# EAGLE design smartcar_shield_cutouts (EAGLE 9.4.0)
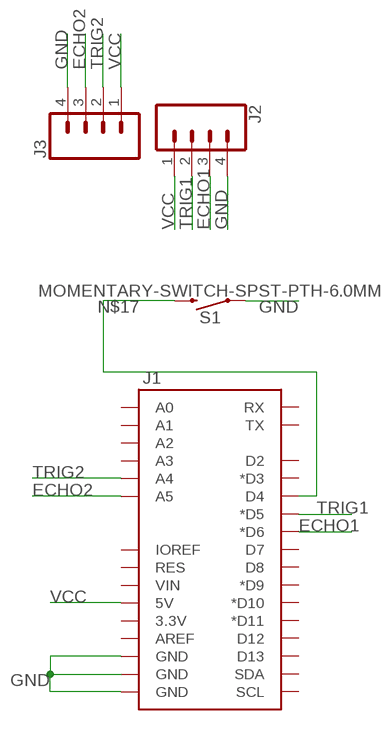
[diagram p0: schematic, sheet 1]

## Parts
J1  ARDUINO_R3_SHIELDUNO_R3_SHIELD_LOCK  [UNO_R3_SHIELD_LOCK]
J2  CONN_04  [1X04]
J3  CONN_04  [1X04]
S1  MOMENTARY-SWITCH-SPST-PTH-6.0MM  [TACTILE_SWITCH_PTH_6.0MM]

## Nets
ECHO1: J1.D6(*D6) J2.3
ECHO2: J1.A5 J3.3
GND: J1.GND@0(GND) J1.GND@1(GND) J1.GND@2(GND) J2.4 J3.4 S1.1
N$17: J1.D4 S1.3
TRIG1: J1.D5(*D5) J2.2
TRIG2: J1.A4 J3.2
VCC: J1.5V J2.1 J3.1
Unconnected: J1.3.3V J1.A0 J1.A1 J1.A2 J1.A3 J1.AREF J1.D2 J1.D3(*D3) J1.D7 J1.D8 J1.D9(*D9) J1.D10(*D10) J1.D11(*D11) J1.D12 J1.D13 J1.IOREF J1.RES J1.RX J1.SCL J1.SDA J1.TX J1.VIN

## Library data of the parts
J1 = SparkFun-Boards:ARDUINO_R3_SHIELD: Shield form compatible with the Arduino Uno R3.
J2 J3 = SparkFun-Connectors:CONN_04: Multi connection point. Often used as Generic Header-pin footprint for 0.1 inch spaced/style header connections On any of the 0.1 inch spaced packages, you can populate with these: Break Away Headers - Straight <https://www.sparkfun.com/products/116> (PRT-00116) Break Away Male Headers - Right Angle <https://www.sparkfun.com/products/553> (PRT-00553) Female Headers <https://www.sparkfun.com/products/115> (PRT-00115) Break Away Headers - Machine Pin <https://www.sparkfun.com/products/117> (PRT-00117) Break Away Female Headers - Swiss Machine Pin <https://www.sparkfun.com/products/743> (PRT-00743) For SCREWTERMINALS and SPRING TERMINALS visit here: Screw Terimnals on SparkFun.com <https://www.sparkfun.com/search/results?term=Screw+Terminals> (5mm/3.5mm/2.54mm spacing) This device is also useful as a general connection point to wire up your design to another part of your project. Our various solder wires solder well into these plated through hole pads. Hook-Up Wire - Assortment (Stranded, 22 AWG) <https://www.sparkfun.com/products/11375> (PRT-11375) Hook-Up Wire - Assortment (Solid Core, 22 AWG) <https://www.sparkfun.com/products/11367> (PRT-11367) View the entire wire category on our website here <https://www.sparkfun.com/categories/141> Special notes: Molex polarized connector foot print use with SKU : PRT-08231 with associated crimp pins and housings. 1MM SMD Version SKU: PRT-10208; PROD_ID: CONN-09696
S1 = SparkFun-Switches:MOMENTARY-SWITCH-SPST: Momentary Switch (Pushbutton) - SPST Normally-open (NO) SPST momentary switches (buttons, pushbuttons). Variants PTH-12MM - 12mm square, through-hole Momentary Pushbutton Switch - 12mm Square <https://www.sparkfun.com/products/9190> (COM-09190) PTH-6.0MM, PTH-6.0MM-KIT - 6.0mm square, through-hole Mini Pushbutton Switch <https://www.sparkfun.com/products/97> (COM-00097) KIT package intended for soldering kit's - only one side of pads' copper is exposed. PTH-RIGHT-ANGLE-KIT - Right-angle, through-hole Right Angle Tactile Button <https://www.sparkfun.com/products/10791> - Used on SparkFun BigTime Watch Kit <https://www.sparkfun.com/products/11734> SMD-12MM - 12mm square, surface-mount Tactile Button - SMD (12mm) <https://www.sparkfun.com/products/12993> (COM-12993) Used on SparkFun PicoBoard <https://www.sparkfun.com/products/11888> SMD-4.5MM - 4.5mm Square Trackball Switch Used on SparkFun Blackberry Trackballer Breakout <https://www.sparkfun.com/products/13169> SMD-4.6MMX2.8MM - 4.60mm x 2.80mm, surface mount Used on SparkFun SAMD21 Mini Breakout <https://www.sparkfun.com/products/13664> SMD-5.2MM, SMD-5.2-REDUNDANT - 5.2mm square, surface-mount Mini Pushbutton Switch - SMD <https://www.sparkfun.com/products/8720> (COM-08720) Used on Arduino Pro Mini <https://www.sparkfun.com/products/11114> REDUNDANT package connects both switch circuits together SMD-6.0X3.5MM - 6.0 x 3.5mm, surface mount Momentary Reset Switch SMD <https://www.sparkfun.com/products/8229> (COM-08229) SMD-6.2MM-TALL - 6.2mm square, surface mount Tactile Button - SMD (6mm) <https://www.sparkfun.com/products/12992> Used on SparkFun Digital Sandbox <https://www.sparkfun.com/products/12651> SMD-RIGHT-ANGLE - Right-angle, surface mount Used on SparkFun Block for Intel® Edison - Arduino <https://www.sparkfun.com/products/13036>; PROD_ID: SWCH-08441; SF_SKU: COM-00097

## Net classes
0 default: width 0.152 mm, drill 0.305 mm, clearance 0.152 mm

## Board
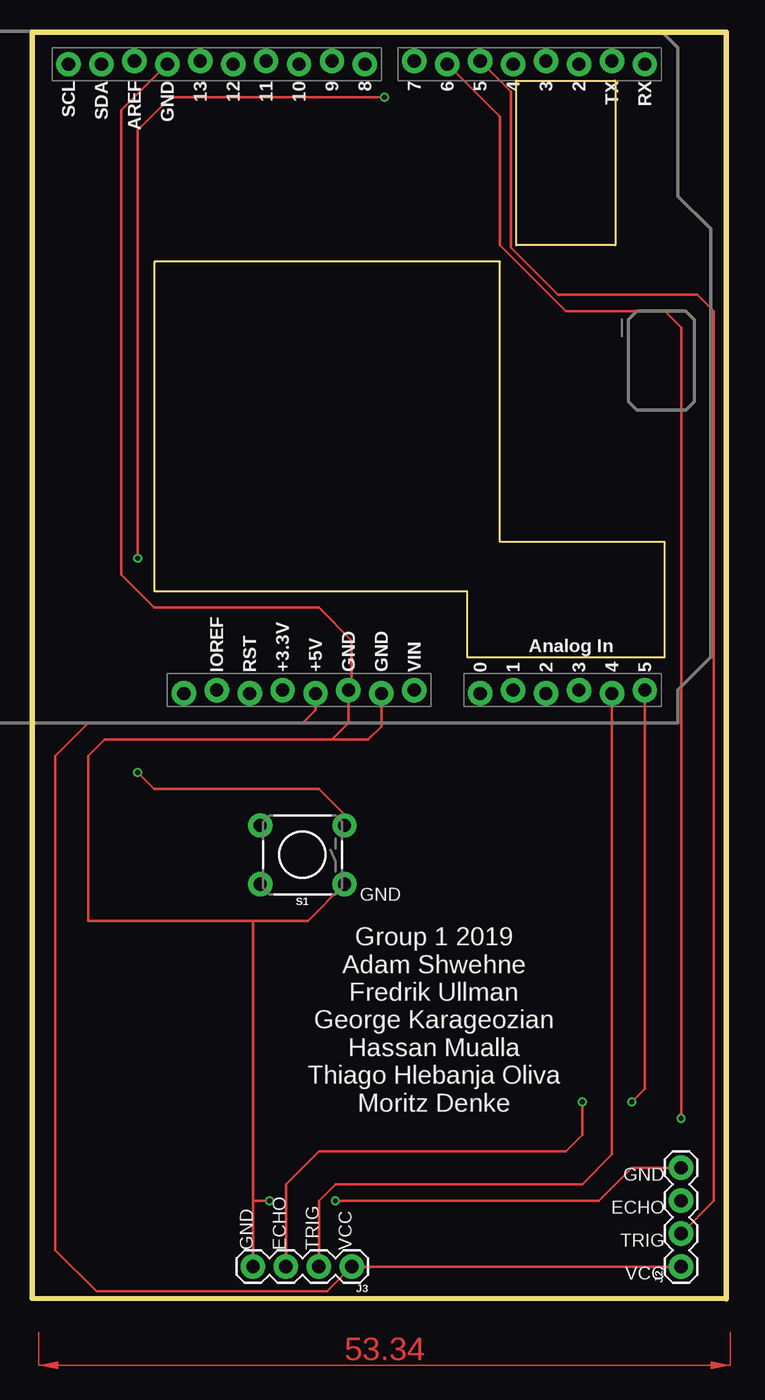
[diagram p1: board, top side]
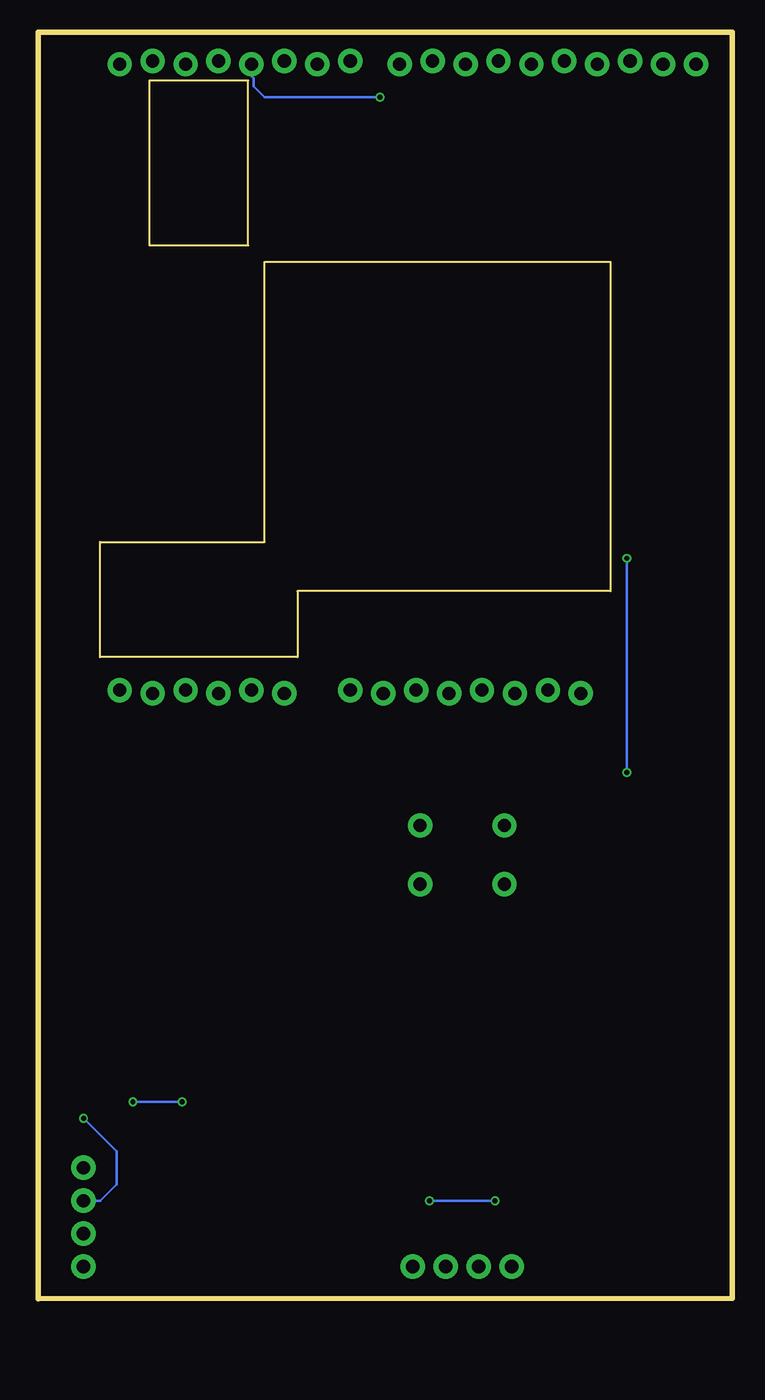
[diagram p2: board, bottom side, seen from below]

Size 53.51 x 97.65 mm. Coordinates in mm from the lower left corner, seen from the top.
Outline: 0,97.65 53.51,97.65 53.51,0 0,0.05 0,97.65
Outline: 9.39,79.96 9.39,54.56 33.52,54.56 33.52,49.48 48.76,49.48 48.76,58.37 36.06,58.37 36.06,79.96 9.39,79.96
Outline: 44.95,81.23 37.33,81.23 37.33,93.93 44.95,93.93 44.95,81.23
Copper layers (1*16): Top 0.035mm / dielectric 1.5mm / Bottom 0.035mm
Design rules "SeeedStudio_2layer_DRU_edited": minimum track width 7mil, minimum drill 15mil, track to track 6mil, track to pad 6mil, pad to pad 6mil, via to via 6mil, smd to smd 0mil, copper to edge 10mil, drill to drill 10mil, minimum pad ring 10mil, minimum via ring 6mil, stop-mask expansion 2mil, vias tented up to drill 100mil, thermal gap 10mil

### Footprints (pad centres in the part's own frame; a part is rotated, then mirrored left to right if it is on the bottom)
UNO_R3_SHIELD_LOCK = drill 1.016 pad 1.88: 3.3V 50.8,26.67; 5V 51.054,29.21; A0 51.054,41.91; A1 50.8,44.45; A2 51.054,46.99; A3 50.8,49.53; A4 51.054,52.07; A5 50.8,54.61; AREF 2.286,15.24; D2 2.54,49.53; D3 2.286,46.99; D4 2.54,44.45; D5 2.286,41.91; D6 2.54,39.37; D7 2.286,36.83; D8 2.54,33.02; D9 2.286,30.48; D10 2.54,27.94; D11 2.286,25.4; D12 2.54,22.86; D13 2.286,20.32; GND@0 50.8,31.75; GND@1 51.054,34.29; GND@2 2.54,17.78; IOREF 50.8,21.59; NC 51.054,19.05; RES 51.054,24.13; RX 2.54,54.61; SCL 2.54,10.16; SDA 2.54,12.7; TX 2.286,52.07; VIN 50.8,36.83
1X04 = drill 1.016 pad 1.88: 1 0,0; 2 2.54,0; 3 5.08,0; 4 7.62,0
TACTILE_SWITCH_PTH_6.0MM = drill 1.016 pad 1.88: 1 -3.251,2.261; 2 3.251,2.261; 3 -3.251,-2.261; 4 3.251,-2.261

### Placement (x,y rotation side)
J1  -7.37,97.74 270 top
J2  50.03,2.49 90 top
J3  24.63,2.49 180 top
S1  20.82,34.24 180 top

### Tracks (layer width: path | path; a pad name or v marks a point on that pad's centre or on a via)
ECHO1  (via drill 0.38)
  Top 0.178: J1.D6 36.06,91.14 36.06,81.23 41.14,76.15 48.76,76.15 50.03,74.88 v50.03,13.92
  Bottom 0.178: v50.03,13.92 47.49,11.38 47.49,8.84 48.76,7.57 J2.3
ECHO2  (via drill 0.38)
  Top 0.178: v46.22,15.19 47.24,16.21 J1.A5 | v42.41,15.19 42.41,12.65 41.14,11.38 22.09,11.38 19.55,8.84 J3.3
  Bottom 0.178: v46.22,15.19 v42.41,15.19
GND  (via drill 0.38)
  Top 0.178: J1.GND@2 6.85,91.64 6.85,55.83 9.39,53.29 22.09,53.29 24.63,50.75 24.63,47.19 J1.GND@0 24.38,44.4 23.11,43.13 | 23.11,43.13 5.58,43.13 4.31,41.86 4.31,29.16 17.01,29.16 | S1.1 21.25,29.16 17.01,29.16 | 17.01,29.16 17.01,7.57 | 17.01,7.57 J3.4 | v18.28,7.57 17.01,7.57 | J1.GND@1 26.92,44.15 25.9,43.13 23.11,43.13 | J2.4 46.22,10.11 43.68,7.57 v23.36,7.57
  Bottom 0.178: v23.36,7.57 v18.28,7.57
N$17  (via drill 0.38)
  Top 0.178: v8.12,40.59 9.39,39.32 22.09,39.32 24.07,37.34 S1.3 | v8.12,57.1 8.12,90.12 10.66,92.66 v27.17,92.66
  Bottom 0.178: v8.12,40.59 v8.12,57.1 | v27.17,92.66 36.06,92.66 36.91,93.51 36.91,94.1 37.08,94.27 J1.D4
TRIG1
  Top 0.178: J1.D5 36.91,93.08 36.91,81.06 40.55,77.42 51.3,77.42 52.57,76.15 52.57,7.57 J2.2
TRIG2
  Top 0.178: J3.2 22.09,7.57 23.36,8.84 42.41,8.84 44.7,11.13 J1.A4
VCC
  Top 0.178: J1.5V 21.84,45.42 20.82,44.4 4.31,44.4 1.77,41.86 1.77,3.76 4.94,0.59 22.73,0.59 J3.1 J2.1
(copper drawn outside any net)
  shapes: Top area x2

### Text on the board
tPlace: GND | Group 1 2019 / Adam Shwehne / Fredrik Ullman / George Karageozian / Hassan Mualla / Thiago Hlebanja Oliva / Moritz Denke | GND | ECHO | TRIG | GND | ECHO | TRIG | VCC | VCC